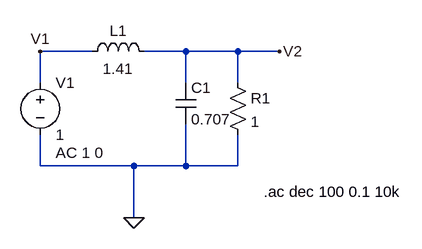
[diagram p0: schematic EJ1.asc]
EJ1.asc, the LTspice schematic file:
Version 4
SHEET 1 880 680
WIRE 80 80 0 80
WIRE 224 80 160 80
WIRE 304 80 224 80
WIRE 368 80 304 80
WIRE 0 128 0 80
WIRE 224 128 224 80
WIRE 304 128 304 80
WIRE 0 256 0 208
WIRE 144 256 0 256
WIRE 224 256 224 192
WIRE 224 256 144 256
WIRE 304 256 304 208
WIRE 304 256 224 256
WIRE 144 336 144 256
FLAG 144 336 0
FLAG 0 80 V1
FLAG 368 80 V2
SYMBOL voltage 0 112 R0
WINDOW 123 24 124 Left 2
WINDOW 39 0 0 Left 0
SYMATTR InstName V1
SYMATTR Value 1
SYMATTR Value2 AC 1 0
SYMBOL res 288 112 R0
SYMATTR InstName R1
SYMATTR Value 1
SYMBOL cap 208 128 R0
SYMATTR InstName C1
SYMATTR Value 0.707
SYMBOL ind 64 96 R270
WINDOW 0 32 56 VTop 2
WINDOW 3 5 56 VBottom 2
SYMATTR InstName L1
SYMATTR Value 1.41
TEXT 344 296 Left 2 !.ac dec 100 0.1 10k

The netlist it stands for:
* EJ1.asc
V1 V1 0 1 AC 1 0
R1 V2 0 1
C1 V2 0 0.707
L1 V1 V2 1.41
.ac dec 100 0.1 10k
.backanno
.end